# EAGLE design Solar-Charger-Board (EAGLE 7.5.0)
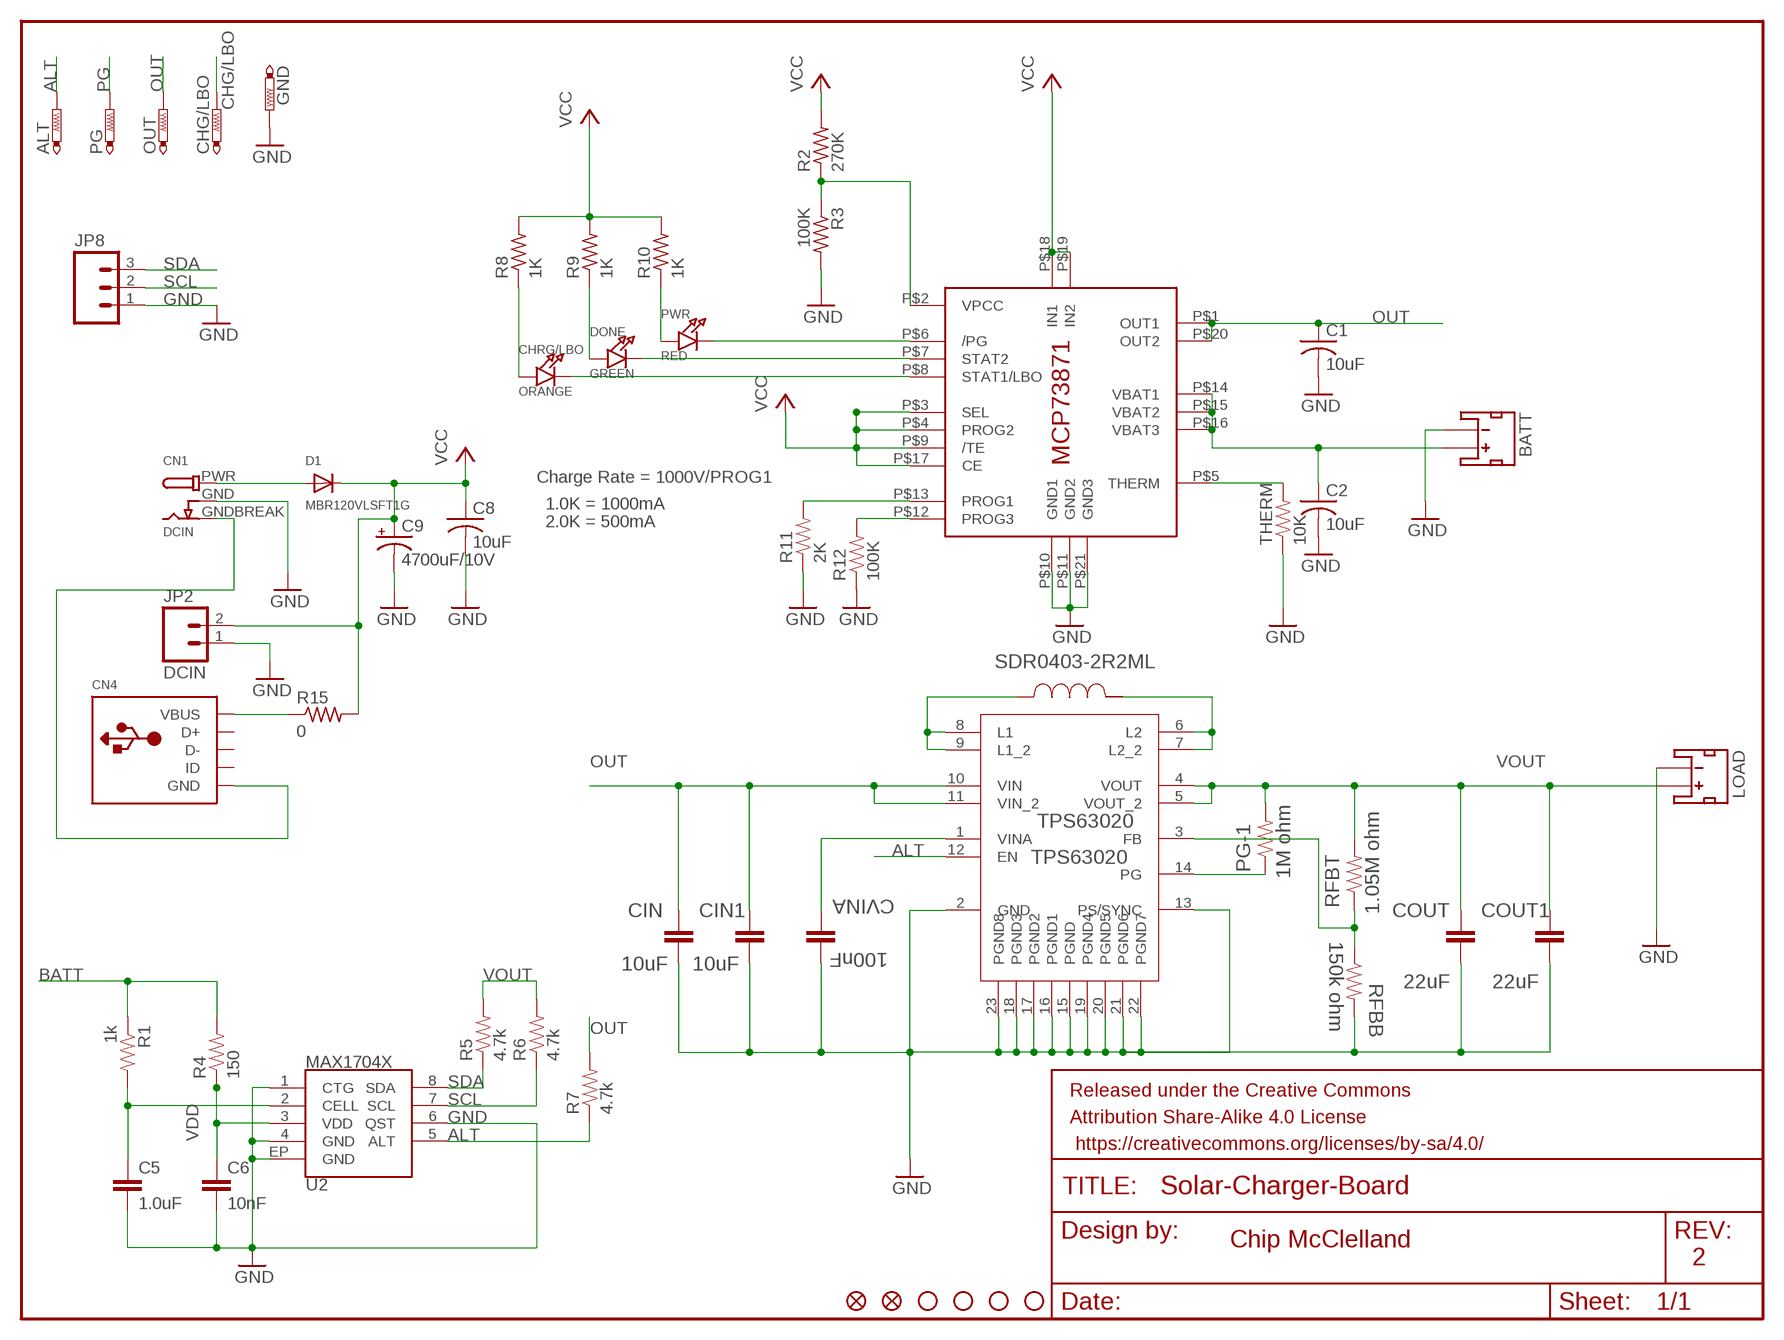
[diagram p0: schematic, sheet 1]

## Parts
ALT  PTR1TP09R  [TP09R]
BATT  JST_2MM_MALE  [JST-2-SMD]
C1  10uF  C-USC0805K  [C0805K]
C2  10uF  C-USC0805K  [C0805K]
C5  1.0uF  1.0UF-25V-+80/-20(0805)  [0805]
C6  10nF  2.2UF-25V-+80/-20(0805)  [0805]
C8  10uF  C-USC0805K  [C0805K]
C9  4700uF/10V  CPOL-USE5-13  [E5-13]
CHG/LBO  PTR1TP09R  [TP09R]
CHRG/LBO  ORANGE  LED0805_NOOUTLINE  [CHIPLED_0805_NOOUTLINE]
CIN  10uF  CAP0805  [0805]
CIN1  10uF  CAP0805  [0805]
CN1  DCIN  DCBARRELSMT  [DCJACK_2MM_SMT]
CN4  USBMINIBLARGE  [USB-MINIB_LARGER]
COUT  22uF  CAP0805  [0805]
COUT1  22uF  CAP0805  [0805]
CVINA  100nF  CAP0805  [0805]
D1  MBR120VLSFT1G  DIODESOD-123  [SOD-123]
DONE  GREEN  LED0805_NOOUTLINE  [CHIPLED_0805_NOOUTLINE]
FID1  FIDUCIALUFIDUCIAL  [MICRO-FIDUCIAL]
FID2  FIDUCIALUFIDUCIAL  [MICRO-FIDUCIAL]
FRAME2  FRAME-LETTER  [CREATIVE_COMMONS]
GND  PTR1TP09R  [TP09R]
JP2  DCIN  M02LOCK  [1X02_LOCK]
JP3  STAND-OFF  [STAND-OFF]
JP4  STAND-OFF  [STAND-OFF]
JP5  STAND-OFF  [STAND-OFF]
JP6  STAND-OFF  [STAND-OFF]
JP8  M03LOCK  [1X03_LOCK]
L1  SDR0403-2R2ML  [SDR0403]
LOAD  JST_2MM_MALE  [JST-2-SMD]
MAX1704X  U2  MAX1704X  [TDFN-8]
MCP73871  U1  MCP73871  [QFN20_4MM]
OUT  PTR1TP09R  [TP09R]
PG  PTR1TP09R  [TP09R]
PG-1  1M ohm  RESISTOR0805-RES  [0805]
PWR  RED  LED0805_NOOUTLINE  [CHIPLED_0805_NOOUTLINE]
R1  1k  RESISTOR0805-RES  [0805]
R2  270K  R-US_R0805  [R0805]
R3  100K  R-US_R0805  [R0805]
R4  150  RESISTOR0805-RES  [0805]
R5  4.7k  RESISTOR0805-RES  [0805]
R6  4.7k  RESISTOR0805-RES  [0805]
R7  4.7k  RESISTOR0805-RES  [0805]
R8  1K  R-US_R0805  [R0805]
R9  1K  R-US_R0805  [R0805]
R10  1K  R-US_R0805  [R0805]
R11  2K  RESISTOR0805-RES  [0805]
R12  100K  RESISTOR0805-RES  [0805]
R15  0  R-US_R0805  [R0805]
RFBB  150k ohm  RESISTOR0805-RES  [0805]
RFBT  1.05M ohm  RESISTOR0805-RES  [0805]
THERM  10K  RESISTOR0805-RES  [0805]
TPS63020  TPS63020  [QFN14-3X4MM]

## Nets
ALT: ALT.TP MAX1704X.5(ALT) R7.1 TPS63020.12(EN)
BATT: BATT.2(+) C2.1 MCP73871.P$14(VBAT1) MCP73871.P$15(VBAT2) MCP73871.P$16(VBAT3) R1.1 R4.2
CHG/LBO: CHG/LBO.TP CHRG/LBO.C MCP73871.P$8(STAT1/LBO)
DONE: DONE.C MCP73871.P$7(STAT2)
FB: RFBB.1 RFBT.1 TPS63020.3(FB)
GND: BATT.1(-) C1.2 C2.2 C5.2 C6.2 C8.2 C9.- CIN1.2 CIN.2 CN1.GND(GNDBREAK) COUT1.2 COUT.2 CVINA.2 GND.TP JP2.1 JP8.1 LOAD.1(-) MAX1704X.1(CTG) MAX1704X.4(GND) MAX1704X.6(QST) MAX1704X.EP(GND) MCP73871.P$10(GND1) MCP73871.P$11(GND2) MCP73871.P$21(GND3) R3.2 R11.1 R12.1 RFBB.2 THERM.1 TPS63020.2(GND) TPS63020.13(PS/SYNC) TPS63020.15(PGND) TPS63020.16(PGND1) TPS63020.17(PGND2) TPS63020.18(PGND3) TPS63020.19(PGND4) TPS63020.20(PGND5) TPS63020.21(PGND6) TPS63020.22(PGND7) TPS63020.23(PGND8)
N$1: L1.1 TPS63020.8(L1) TPS63020.9(L1_2)
N$3: C5.1 MAX1704X.2(CELL) R1.2
N$4: L1.2 TPS63020.6(L2) TPS63020.7(L2_2)
N$5: CN4.VBUS R15.1
N$6: MCP73871.P$2(VPCC) R2.1 R3.1
N$7: CVINA.1 TPS63020.1(VINA)
N$8: MCP73871.P$5(THERM) THERM.2
N$10: CN1.PWR D1.A
N$12: CHRG/LBO.A R8.1
N$13: DONE.A R9.1
N$14: PWR.A R10.1
N$15: MCP73871.P$12(PROG3) R12.2
N$16: MCP73871.P$13(PROG1) R11.2
N$18: CN1.GNDBREAK(GND) CN4.GND CN4.GND1(GND) CN4.GND2(GND) CN4.GND3(GND) CN4.GND4(GND)
OUT: C1.1 CIN1.1 CIN.1 MCP73871.P$1(OUT1) MCP73871.P$20(OUT2) OUT.TP R7.2 TPS63020.10(VIN) TPS63020.11(VIN_2)
PG: PG-1.1 PG.TP TPS63020.14(PG)
PWR: MCP73871.P$6(/PG) PWR.C
SCL: JP8.2 MAX1704X.7(SCL) R6.1
SDA: JP8.3 MAX1704X.8(SDA) R5.1
VCC: C8.1 C9.+ D1.C JP2.2 MCP73871.P$3(SEL) MCP73871.P$4(PROG2) MCP73871.P$9(/TE) MCP73871.P$17(CE) MCP73871.P$18(IN1) MCP73871.P$19(IN2) R2.2 R8.2 R9.2 R10.2 R15.2
VDD: C6.1 MAX1704X.3(VDD) R4.1
VOUT: COUT1.1 COUT.1 LOAD.2(+) PG-1.2 R5.2 R6.2 RFBT.2 TPS63020.4(VOUT) TPS63020.5(VOUT_2)
Unconnected: BATT.NC1(PAD1) BATT.NC2(PAD2) CN4.D+ CN4.D- CN4.ID LOAD.NC1(PAD1) LOAD.NC2(PAD2)

## Notes on the sheet
- Charge Rate = 1000V/PROG1
- 1.0K = 1000mA
- 2.0K = 500mA
- Chip McClelland
- 2

## Library data of the parts
ALT CHG/LBO GND OUT PG = testpad:PTR1: TEST PIN
BATT LOAD = SparkFun-Connectors:JST_2MM_MALE: Mates to single-cell LiPo batteries. CONN-08352; PROD_ID: CONN-08352
C1 C2 C8 = adafruit:C-US: CAPACITOR, American symbol
C5 = SparkFun-Capacitors:1.0UF-25V-+80/-20(0805): CAP-11625; PROD_ID: CAP-11625
C6 = SparkFun-Capacitors:2.2UF-25V-+80/-20(0805): CAP-11624; PROD_ID: CAP-11624; VALUE: 2.2uF
C9 = adafruit:CPOL-US: POLARIZED CAPACITOR, American symbol
CHRG/LBO DONE PWR = microbuilder:LED: LED 0603 - 0603 Surface Mount Package 2mA: Green LED - Low Power (3.9mcd, 2ma, 1.7Vf) - Digikey: 475-2709-2-ND Orange LED - Low Power (9.8mcd, 2ma, 1.8Vf) - Digikey: 475-1194-2-ND Red LED - Low Power (5mcd, 2ma, 1.8Vf) - Digikey: 475-1195-2-ND Yellow LED - Low Power (7mcd, 2ma, 1.8Vf) - Digikey: 475-1196-2-ND 5mA: Blue LED - Low Power (17mcd, 5ma, 2.9Vf) - Digikey: LNJ937W8CRACT-ND 0805 - 0805 Surface Mount Package 2mA: Red LED (8.8mcd, 2mA, 1.8Vf, Clear) - Low Power [Digikey: 475-2510-1-ND] Green LED (5mcd, 2mA, 1.8Vf, Clear) - Low Power [Digikey: 475-2730-1-ND] Yellow LED (11.3mcd, 2mA, 1.8Vf, Clear) - Low Power [Digikey: 475-2555-1-ND] 20mA: Red LED (104mcd, 20mA, Diffused) - LS R976 [Digikey: 475-1278-6-ND] Red LED (12mcd, 20mA, 2.0Vf, Clear) - APT2012EC [Digikey: 754-1128-1-ND] Green LED (15mcd, 20mA, 2.2Vf, Clear) - APT2012GC [Digikey: 754-1131-1-ND] Orange LED (160mcd, 20mA, 2.1Vf, Clear) - APT2012SECK [Digikey: 754-1130-1-ND] 1206 - 1206 Surface Mount Package Green LED (26mcd, 20mA, Diffused) - LG N971 [Digikey: 475-1407-6-ND] Red LED (15mcd, 20mA, Diffused) - LH N974 [Digikey: 475-1416-6-ND] Cree - Cree High-Power Surface Mount LEDs XPEBWT-L1-0000-00D50 - White 111lm 350mA 2.9Vf 6200K 110° XTEAWT-00-0000-00000LEE3 - White 114lm 350mA 2.85Vf 5000K 115° Everlight - Everlight 45-21 Series Surface Mount LEDs 45-21/QK2C-B2832AC2CB2/2T - Warm White 2000mcd 20mA 3.25Vf 3050K 120° 45-21/LK2C-B38452C4CB2/2T - Nuetral White 2000mcd 20mA 3.25Vf 4150K 120° 45-21/LK2C-B50634C6CB2/2T - Cold White 2200mcd 20mA 3.25Vf 5650K 120° PLCC2 Reverse Mount LS T77K-J1L2-1-0-2-R18-Z - Red 11.25mcd 2mA 1.8Vf 630nm 120° LO T77K-L1M2-24-Z - Orange 19.6mcd 2mA 1.8Vf 606nm 120° LY T77K-K2M1-26-Z - Yellow 15.7mcd 2mA 1.8Vf 587nm 120°
CIN CIN1 COUT COUT1 CVINA = SparkFun-Passives:CAP: Capacitor Standard 0603 ceramic capacitor, and 0.1" leaded capacitor.
CN1 = microbuilder:DCBARREL: DC Barrel Jack DCJACK_1.3MM_PTH - Through Hole 1.3mm Jack (4UConnector: 05536) DCJACK_2MM_PTH - Through Hole 2.0/2.1 Jack (4UConnector: 05537) DCJACK_2MM_SMT - SMT 2.0/2.1mm Jack(4UConnector: 03267)
CN4 = microbuilder:USB: USB Connectors USBMINIB - Surface Mount Female Mini-B USB Connector 4UConnector: 06564
D1 = microbuilder:DIODE: Diode SMA Model Volts Amps Type Vf Vr Digikey # Notes SSA34-E3 40V 3A Schottky 480mV @ 3A 200uA @ 40V SSA34-E3/61TGITR-ND CDBA120-G 20V 1A Schottky 500mV @ 1A 500uA @ 20V 641-1014-6-ND REEL MBRA210 10V 2A Schottky 350mV @ 2A 700uA @ 10V MBRA210LT3 SOD-123 Model Volts Amps Type Vf Vr Order # Notes BAT54T1G 30V 200mA Schottky 800mV @ 200mA 2uA @ 25V BAT54T1GOSTR-ND B0530W 30V 500mA Schottky 430mV @ 500mA 130uA @ 30V B0530W-FDICT-ND REEL MBR120 20V 1A Schottky 340mV @ 1A MBR120VLSFT1GOSCT-ND SOD-323 Model Volts Amps Type Vf Vr Order # Notes PMEG2005EJ 20V 500mA Schottky 355mV @ 500mA 568-4110-1-ND ZLLS410 10V 570mA Schottky 380mV @ 570mA ZLLS410CT-ND 1N4148WS 75V 150mA Silicon/Simple 1V 1N4148WSFSCT-ND REEL SOD-523 Model Volts Amps Type Vf Vr Order # Notes BAT54XV2 30V 200mA Schottky 0.8V @ 100mA BAT54XV2CT-ND TB751S 30V 30mA Schottky RB751S-40TE61CT-ND SOT23-R/W (R = Solder Paste/Reflow Ovens, W = Hand-Soldering) Model Volts Amps Type Vf Vr Order # Notes BAT54FILM 40V 300mA Schottky 497-7162-1-ND
FID1 FID2 = SparkFun-Aesthetics:FIDUCIAL: Fiducial Alignment Points Various fiducial points for machine vision alignment.
FRAME2 = SparkFun-Aesthetics:FRAME-LETTER: Schematic Frame Standard 8.5x11 US Letter frame
JP2 = SparkFun-Connectors:M02: Standard 2-pin 0.1" header. Use with - straight break away headers ( PRT-00116) - right angle break away headers (PRT-00553) - swiss pins (PRT-00743) - machine pins (PRT-00117) - female headers (PRT-00115) Molex polarized connector foot print use with: PRT-08233 with associated crimp pins and housings. 2.54_SCREWTERM for use with PRT-10571. 3.5mm Screw Terminal footprints for PRT-08084 5mm Screw Terminal footprints for use with PRT-08433
JP3-JP6 = SparkFun:STAND-OFF: Stand Off This is the mechanical footprint for a #4 phillips button head screw. Use the keepout ring to avoid running the screw head into surrounding components. SKU : PRT-00447
JP8 = SparkFun-Connectors:M03: Header 3 Standard 3-pin 0.1" header. Use with straight break away headers (SKU : PRT-00116), right angle break away headers (PRT-00553), swiss pins (PRT-00743), machine pins (PRT-00117), and female headers (PRT-00115). Molex polarized connector foot print use with SKU : PRT-08232 with associated crimp pins and housings.
L1 = TPS63020:SDR0403-2R2ML; DCR: 0.047; IDC: 2.6; L: 2.2E-6; MANUFACTURER_NAME: Bourns; MANUFACTURER_PART_NUMBER: SDR0403-2R2ML; VENDOR: Bourns
MAX1704X = SparkFun:MAX1704X: MAX17043/MAX17044: Battery Fuel Guage (43 is 1cell, 44 is 2cell)
MCP73871 = adafruit:MCP73871
PG-1 R1 R4-R7 R11 R12 RFBB RFBT THERM = SparkFun-Passives:RESISTOR: Resistor Basic schematic elements and footprints for 0603, 1206, and PTH resistors.
R2 R3 R8-R10 R15 = adafruit:R-US_: RESISTOR, American symbol
TPS63020 = TI Power and Battery:TPS63020

## Net classes
0 default: width 0.203 mm, drill 0.33 mm

## Board
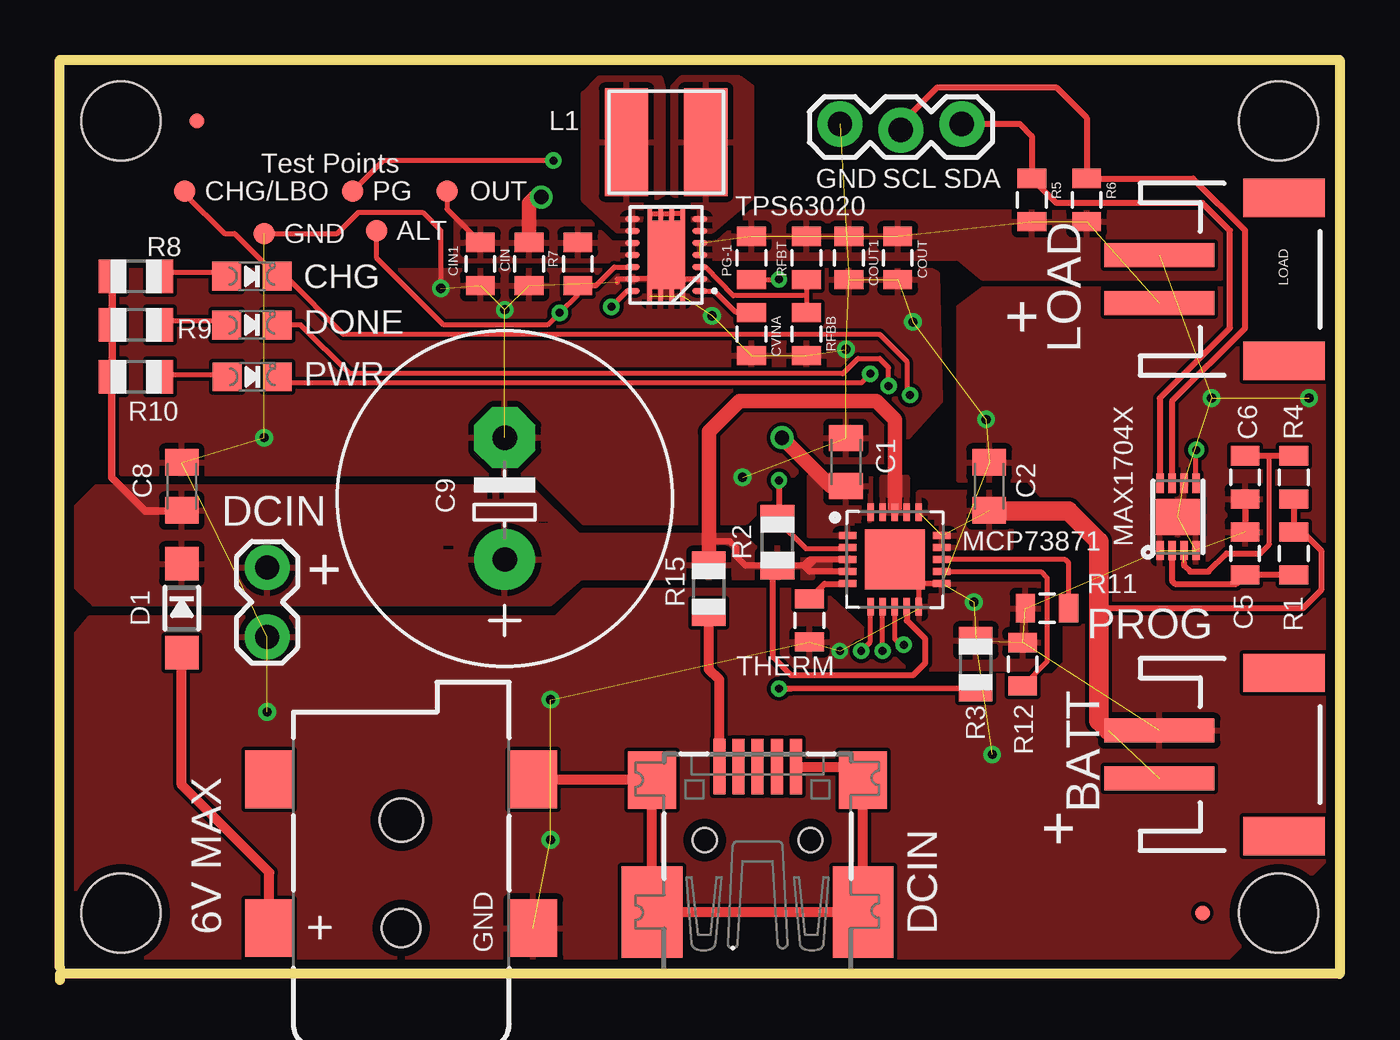
[diagram p1: board, top side]
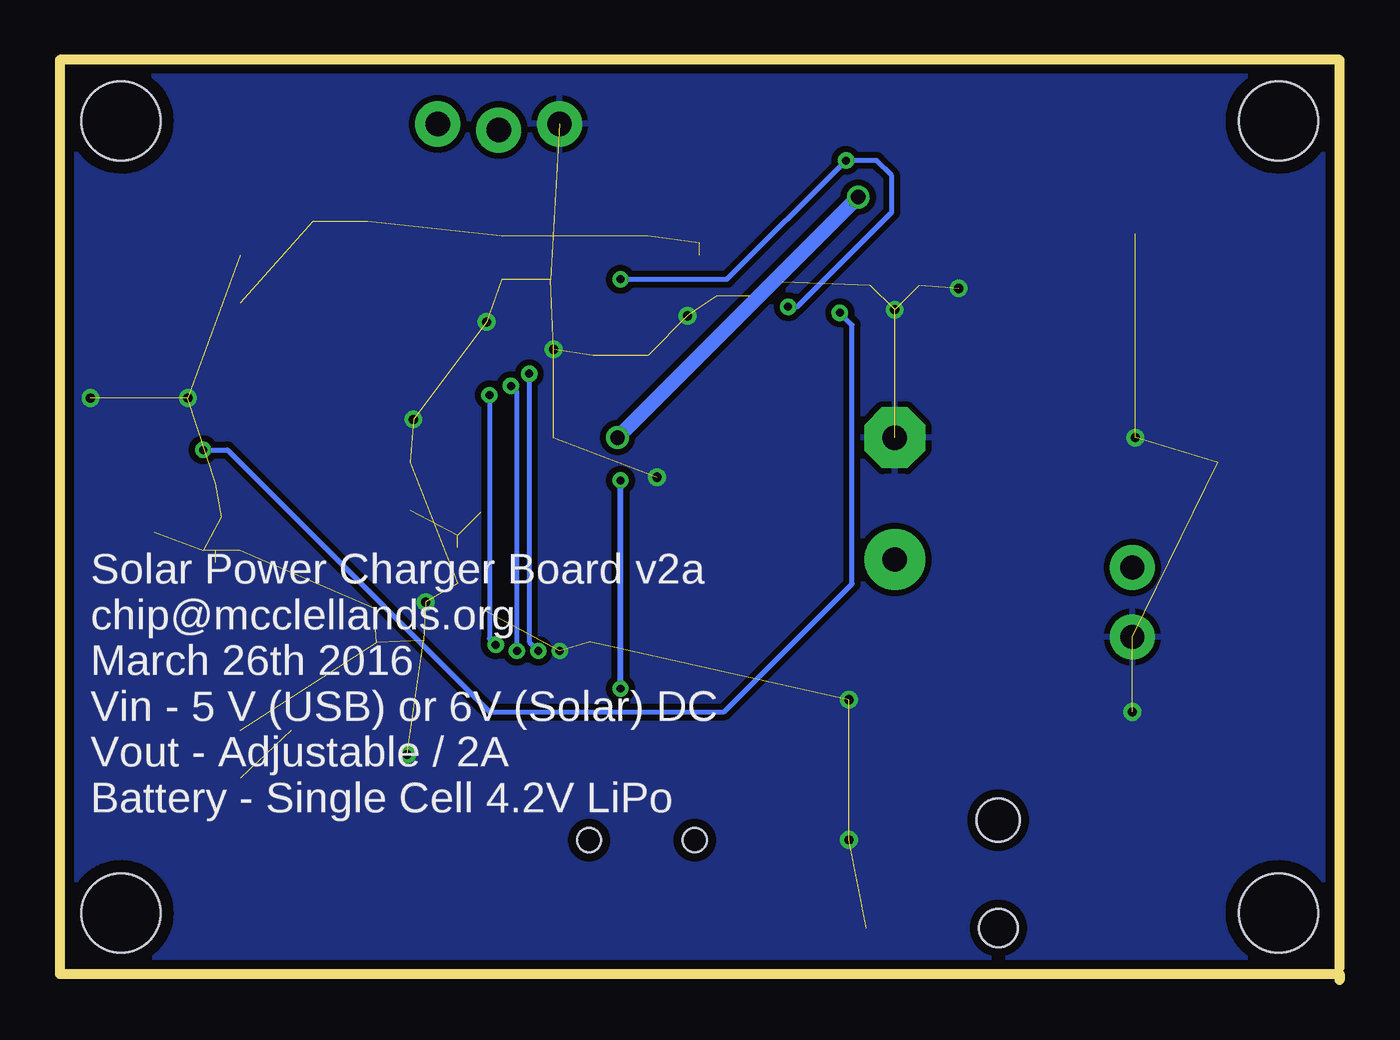
[diagram p2: board, bottom side, seen from below]

Size 53.34 x 38.35 mm. Coordinates in mm from the lower left corner, seen from the top.
Outline: 0,0.51 0,38.35 53.34,38.35 53.34,0.25 0,0.25 0,0
Copper layers (1*16): Top 0.0356mm / dielectric 1.5011mm / Bottom 0.0356mm
Design rules "LaenPCBOrder": minimum track width 6mil, minimum drill 13mil, track to track 6mil, track to pad 6mil, pad to pad 6mil, via to via 6mil, smd to smd 6mil, copper to edge 15mil, drill to drill 6mil, minimum pad ring 7mil, minimum via ring 7mil, stop-mask expansion 3mil, vias tented up to drill 0mil, thermal gap 10mil
tRestrict: area 16,18 to 16.4,18.1; 9 lines

### Footprints (pad centres in the part's own frame; a part is rotated, then mirrored left to right if it is on the bottom)
TP09R = smd 0.9 x 0.9: TP 0,0
JST-2-SMD = smd 1 x 4.6: 1 -1,-3.7; 2 1,-3.7 | smd 1.6 x 3.4: NC1 -3.4,1.5; NC2 3.4,1.5
C0805K = smd 1.1 x 1.4: 1 -1,0; 2 1,0
0805 = smd 0.8 x 1.2: 1 -0.9,0; 2 0.9,0
E5-13 = drill 1.016 pad 2.54: + -2.54,0 | drill 1.016 pad 2.54 octagon: - 2.54,0
CHIPLED_0805_NOOUTLINE = smd 1.2 x 1.2: A 0,-1.05; C 0,1.05
DCJACK_2MM_SMT = smd 2.4 x 2: GND 0,-5.5; GNDBREAK 6.2,-5.5; PWR 0,5.5; PWR2 6.2,5.5 | hole 1.6: 0,0 | hole 1.8: 4.5,0
USB-MINIB_LARGER = smd 0.5 x 2.308: D+ 0,4.064; D- -0.8,4.064; GND 1.6,4.064; ID 0.8,4.064; VBUS -1.6,4.064 | smd 2.54 x 3.81: GND1 -4.4,-2; GND4 4.4,-2 | smd 2 x 2.4: GND2 -4.4,3.5; GND3 4.4,3.5 | hole 1: -2.2,1; 2.2,1
SOD-123 = smd 1.4 x 1.4: A 1.85,0; C -1.85,0
MICRO-FIDUCIAL = smd 0.635 x 0.635: 1 0,0
1X02_LOCK = drill 1.016 pad 1.88: 1 -0.178,0; 2 2.718,0
STAND-OFF = hole 3.302: 0,0
1X03_LOCK = drill 1.016 pad 1.88: 1 0,0.127; 2 2.54,-0.127; 3 5.08,0.127
SDR0403 = smd 1.803 x 4.496: 1 -1.651,0; 2 1.651,0
TDFN-8 = smd 0.8 x 0.3: 1 -1.4,0.75; 2 -1.4,0.25; 3 -1.4,-0.25; 4 -1.4,-0.75; 5 1.4,-0.75; 6 1.4,-0.25; 7 1.4,0.25; 8 1.4,0.75 | smd 1.5 x 1.88: EP 0,0
QFN20_4MM = smd 0.73 x 0.28: P$1 -1.965,1; P$2 -1.965,0.5; P$3 -1.965,0; P$4 -1.965,-0.5; P$5 -1.965,-1; P$11 1.965,-1; P$12 1.965,-0.5; P$13 1.965,0; P$14 1.965,0.5; P$15 1.965,1 | smd 0.28 x 0.73: P$6 -1,-1.965; P$7 -0.5,-1.965; P$8 0,-1.965; P$9 0.5,-1.965; P$10 1,-1.965; P$16 1,1.965; P$17 0.5,1.965; P$18 0,1.965; P$19 -0.5,1.965; P$20 -1,1.965 | smd 2.5 x 2.5: P$21 0,0
R0805 = smd 1.1 x 1.4: 1 -1,0; 2 1,0
QFN14-3X4MM = smd 0.6 x 0.24: 1 -1.4,1.5; 2 -1.4,1; 3 -1.4,0.5; 4 -1.4,0; 5 -1.4,-0.5; 6 -1.4,-1; 7 -1.4,-1.5; 8 1.4,-1.5; 9 1.4,-1; 10 1.4,-0.5; 11 1.4,0; 12 1.4,0.5; 13 1.4,1; 14 1.4,1.5 | smd 1.58 x 2.85: 15 0,0 | smd 0.2 x 0.575: 16 -0.69,1.712; 17 -0.23,1.712; 18 0.23,1.712; 19 0.69,1.712; 20 0.69,-1.712; 21 0.23,-1.712; 22 -0.23,-1.712; 23 -0.69,-1.712

### Placement (x,y rotation side)
ALT  13.21,31.24 0 top
BATT  49.53,9.4 270 top
C1  32.77,21.59 90 top
C2  38.73,20.57 90 top
C5  49.4,17.78 90 top
C6  49.4,20.96 270 top
C8  5.08,20.57 90 top
C9  18.54,20.07 90 top
CHG/LBO  5.21,32.89 0 top
CHRG/LBO  8,29.34 270 top
CIN  19.56,29.85 270 top
CIN1  17.53,29.85 270 top
CN1  14.22,2.16 90 top
CN4  29.08,4.83 0 top
COUT  34.92,30.1 270 top
COUT1  32.89,30.1 270 top
CVINA  28.83,26.92 270 top
D1  5.08,15.49 270 top
DONE  8,27.3 270 top
FID1  47.62,2.79 0 top
FID2  5.71,35.81 0 top
FRAME2  0,0.25 0 top
GND  8.51,31.12 0 top
JP2  8.64,14.48 90 top
JP3  2.54,35.81 0 top
JP4  50.8,35.81 0 top
JP5  50.8,2.79 0 top
JP6  2.54,2.79 0 top
JP8  32.51,35.56 0 top
L1  25.27,34.92 0 top
LOAD  49.53,29.21 270 top
MAX1704X  46.61,19.3 90 top
MCP73871  34.8,17.53 0 top
OUT  16.13,32.89 0 top
PG  12.19,32.89 0 top
PG-1  28.83,30.1 90 top
PWR  8.02,25.15 270 top
R1  51.44,17.78 270 top
R2  29.91,18.24 270 top
R3  38.18,13.16 90 top
R4  51.44,20.96 270 top
R5  40.51,32.51 270 top
R6  42.8,32.51 270 top
R7  21.59,29.85 90 top
R8  3.17,29.34 180 top
R9  3.17,27.3 180 top
R10  3.17,25.15 180 top
R11  41.15,15.49 0 top
R12  40.13,13.16 270 top
R15  27.05,16.31 90 top
RFBB  31.11,26.92 270 top
RFBT  31.11,30.1 90 top
THERM  31.24,14.99 90 top
TPS63020  25.27,30.23 180 top

### Tracks (layer width: path | path; a pad name or v marks a point on that pad's centre or on a via)
ALT  (via drill 0.33)
  Top 0.203: TPS63020.12 23.11,29.72 22.34,28.95 R7.1 21.59,28.58 v20.83,27.81 20.32,27.3 16,27.3 13.21,30.1 ALT.TP | MAX1704X.5 v47.36,22.09 v47.37,22.1
  Bottom 0.203: v47.37,22.1 46.35,22.1 35.43,11.18 25.65,11.18 20.32,16.51 20.32,27.3 v20.83,27.81
BATT  (4 unrouted)
  Top 0.203: 35.76,19.61 MCP73871.P$16
  Top 0.254: R4.2 R1.1 51.8,18.68 52.58,17.91 52.58,16.26 51.82,15.49 43.56,15.49 43.31,15.75
  Top 0.813: 43.7,10.4 43.31,10.79 43.31,15.75 43.31,18.29 42.04,19.56 38.75,19.56 C2.1
  pour Top: 35.81,19.3 35.81,20.32 39.62,20.32 39.62,18.03 36.58,18.03 36.58,19.3
CHG/LBO  (via drill 0.33)
  Top 0.203: v35.43,24.38 35.31,24.51 35.31,25.78 34.16,26.92 11.81,26.92 9.4,29.34 CHRG/LBO.C 7.27,31.12 6.86,31.12 5.21,32.77 CHG/LBO.TP | v35.18,13.97 35.05,13.97 34.8,14.22 MCP73871.P$8
  Bottom 0.203: v35.43,24.38 35.43,14.22 v35.18,13.97
DONE  (via drill 0.33)
  Top 0.203: v34.29,13.72 34.29,15.55 MCP73871.P$7 | v34.54,24.77 34.54,25.53 34.16,25.91 33.27,25.91 32.64,25.27 12.06,25.27 10.03,27.3 DONE.C
  Bottom 0.203: v34.29,13.72 34.29,24.51 v34.54,24.77
FB
  Top 0.203: 31.11,28.52 RFBB.1 | RFBT.1 31.11,28.52 | 31.11,28.52 28.07,28.52 26.92,29.72 26.68,29.72 TPS63020.3
GND  (via drill 0.33, 0.38)  (45 unrouted)
  Top 0.203: MCP73871.P$11 35.58,16.53 35.56,16.51 35.81,16.51 | 35.81,15.49 35.81,16.51 | 35.81,16.51 MCP73871.P$21 | TPS63020.22 25.5,30.23 TPS63020.15 24.77,30.23 24.77,29.21 24.59,29.24 | TPS63020.20 TPS63020.21 TPS63020.22 | TPS63020.23 TPS63020.22 | 24.59,29.24 23.88,29.24 TPS63020.13 23.24,29.23 23.24,29.08 | TPS63020.19 24.59,28.5 24.59,29.24 | TPS63020.2 26.04,29.23 | 26.04,29.23 25.8,29.23 25.78,29.21 | TPS63020.16 25.96,29.15 26.04,29.23 | GND.TP 11.56,31.12 12.45,32 15.11,32 15.88,31.24 v15.88,28.83
  Top 0.254: C6.2 C5.2
  other vias: 38.61,23.37 38.86,9.4 38.1,15.75 20.45,5.84 20.45,11.68 8.64,11.18 32.51,13.72 8.51,22.61 48.01,24.26 52.07,24.26 28.45,20.96 18.54,27.94 32.77,26.29 35.56,27.43 27.18,27.69
  pour Bottom (isolate 0.254): -4.06,-2.03 -3.94,39.78 54.65,39.65 54.65,-1.78
  pour Top: 41.15,16.51 41.15,12.95 35.81,12.95 35.81,16.51
  pour Top: 1.27,15.11 20.7,15.11 21.84,16.26 31.75,16.26 35.56,12.7 41.4,12.7 41.91,13.21 41.91,19.05 40.39,20.83 37.47,20.83 37.47,28.07 38.48,28.83 51.94,28.83 52.96,28.19 53.09,5.33 48.51,0.76 2.79,0.76 0.51,3.05 0.51,14.22
  pour Top: 19.81,21.08 1.65,21.08 0.76,21.97 0.76,29.08 2.29,29.59 36.32,29.59 36.58,29.46 36.7,24.13 34.42,21.59 31.11,21.59 28.57,19.05 21.84,19.05
N$1
  pour Top: 23.88,31.24 23.24,31.24 21.84,32.51 21.84,36.96 22.48,37.59 25.02,37.59 25.12,37.21 25.12,32.77 24.51,32.38 24.26,32.13 24.13,31.5
N$3
  Top 0.254: MAX1704X.2 46.35,16.64 46.48,16.51 49.03,16.51 C5.1 R1.2
N$4
  pour Top: 26.67,31.24 27.18,31.24 28.83,32.64 28.83,37.21 28.32,37.59 25.91,37.59 25.55,37.21 25.55,32.77 26.42,32.51 26.42,31.5
N$5
  Top 0.406: CN4.VBUS 27.48,12.52 27.05,12.95 R15.1
N$6  (via drill 0.33)
  Top 0.203: MCP73871.P$2 32.72,17.98 31.09,17.98 29.87,19.2 R2.1
  Top 0.254: R3.1 30.48,12.14 v29.97,12.14 | v29.97,20.83 29.97,19.3 R2.1
  Bottom 0.254: v29.97,12.14 v29.97,20.83
N$7
  Top 0.203: CVINA.1 28.18,27.82 27.3,28.7 26.7,28.7 TPS63020.1
N$8
  Top 0.203: 32.92,16.56 MCP73871.P$5
  Top 0.254: THERM.2 31.25,15.89 31.88,16.51 32.82,16.51 MCP73871.P$5
N$10
  Top 0.406: CN1.PWR 8.72,4.48 5.08,8.13 D1.A
N$12
  Top 0.203: CHRG/LBO.A 6.86,29.52 4.22,29.52 R8.1
N$13
  Top 0.203: DONE.A 6.86,27.48 4.22,27.48 R9.1
N$14
  Top 0.203: PWR.A 6.86,25.25 4.22,25.25 R10.1
N$15
  Top 0.203: MCP73871.P$12 40.89,17.03 41.15,16.76 41.15,13.28 R12.2
N$16
  Top 0.203: R11.2 42.05,17.39 41.91,17.53 MCP73871.P$13
N$18
  Top 0.406: CN1.GNDBREAK 24.65,8.36 CN4.GND2 CN4.GND1 CN4.GND4 CN4.GND3 32.92,8.89 CN4.GND
OUT  (via drill 0.6)
  Top 0.203: OUT.TP 16.13,32.14 CIN1.1
  Top 0.61: C1.1 32.12,20.59 v30.1,22.61 | v20.07,32.64 19.81,32.64 19.56,32.38 CIN.1
  Bottom 0.61: v30.1,22.61 v20.07,32.64
  pour Top: 33.78,19.18 33.78,20.96 31.24,20.96 31.24,18.54 33.02,18.54 33.02,19.18
  pour Top: 23.24,29.97 16.51,29.97 16.51,31.62 22.1,31.62 22.99,30.73 23.88,30.73 24,30.61 24,30.35 23.88,30.23 23.5,30.23
PG  (via drill 0.33)
  Top 0.203: TPS63020.14 23.65,28.73 v22.99,28.07 | PG-1.1 29.96,29.2 v29.97,29.21 | v20.57,34.16 13.46,34.16 PG.TP
  Bottom 0.203: v29.97,29.21 25.53,29.21 v20.57,34.16 19.3,34.16 18.67,33.53 18.67,32 22.61,28.07 v22.99,28.07
PWR  (via drill 0.33)
  Top 0.203: v33.4,13.72 33.78,14.1 33.78,15.54 MCP73871.P$6 | v33.78,25.27 33.4,24.89 9.32,24.89 PWR.C
  Bottom 0.203: v33.78,25.27 33.78,14.1 v33.4,13.72
SCL
  Top 0.254: JP8.2 35.05,35.69 36.58,37.21 41.53,37.21 42.8,35.94 R6.1 47.23,33.41 49.4,31.24 49.4,27.18 46.35,24.13 MAX1704X.7
SDA
  Top 0.254: MAX1704X.8 45.85,20.72 45.85,24.26 48.77,27.18 48.77,31.24 47.62,32.38 41.54,32.38 R5.1 40.51,35.18 40.01,35.69 JP8.3
VCC
  Top 0.203: 34.8,19.69 MCP73871.P$18 | 32.92,17.58 MCP73871.P$3 32.92,17.58
  Top 0.254: 5.06,19.56 C8.1 | MCP73871.P$4 31.23,17.03 30.99,17.27 | 30.99,17.27 29.94,17.27 R2.2 29.72,17.05 29.72,13.46 30.48,12.7 35.56,12.7 36.07,13.21 36.07,14.22 35.31,14.99 35.31,15.55 MCP73871.P$9 | MCP73871.P$3 31.24,17.53 30.99,17.27 | 32.92,17.58 32.92,17.55 32.89,17.53 31.5,17.53 31.24,17.27 28.57,17.27 28.19,17.65 28.19,18.03 27.94,18.29 27.05,18.29 | 34.04,24.13 34.16,24.13 34.8,23.37
  Top 0.305: 5.06,19.56 3.56,19.56 2.16,20.96 2.16,25.13 R10.2 R9.2 R8.2
  Top 0.61: R15.2 27.05,18.29 27.05,22.86 28.32,24.13 34.04,24.13 34.8,23.37 34.8,19.69
  pour Top: 33.02,17.53 31.37,17.53 31.37,17.02 33.02,17.02
  pour Top: 31.37,16.76 21.72,16.76 20.45,15.67 1.4,15.67 0.51,16.51 0.51,19.56 1.52,20.57 19.56,20.57 21.59,18.54 28.45,18.54 28.96,18.03 30.23,18.03 30.73,17.53 31.37,17.53
  pour Top: 35.31,19.3 34.29,19.3 34.29,20.96 35.31,20.96
VDD  (1 unrouted)
  Top 0.203: 50.04,17.78 50.42,18.16 50.42,21.86
  Top 0.254: C6.1 50.42,21.86 R4.1 | 46.86,17.4 46.86,17.28 47.12,17.02 47.88,17.02 48.64,17.78 50.04,17.78
VOUT  (8 unrouted)
  pour Top: 26.67,30.23 26.67,30.61 26.8,30.73 27.43,30.73 28.83,32 47.88,32 49.15,30.86 49.15,29.97 48.39,29.26 38.48,29.26 37.47,30.1 26.8,30.1

### Text on the board
tPlace: Test Points | GND | SCL | SDA | CHG | DONE | + | LOAD | PWR | DCIN | + | PROG | BATT | + | 6V MAX | DCIN
bPlace: Solar Power Charger Board v2a / chip@mcclellands.org / March 26th 2016 / Vin - 5 V (USB) or 6V (Solar) DC / Vout - Adjustable / 2A / Battery - Single Cell 4.2V LiPo